# Altium schematic sheet 04_Inputs_19-27.SchDoc
size 594 x 420 mm; DocumentNumber: Входы сухой контакт; SheetNumber: 4; SheetTotal: 6
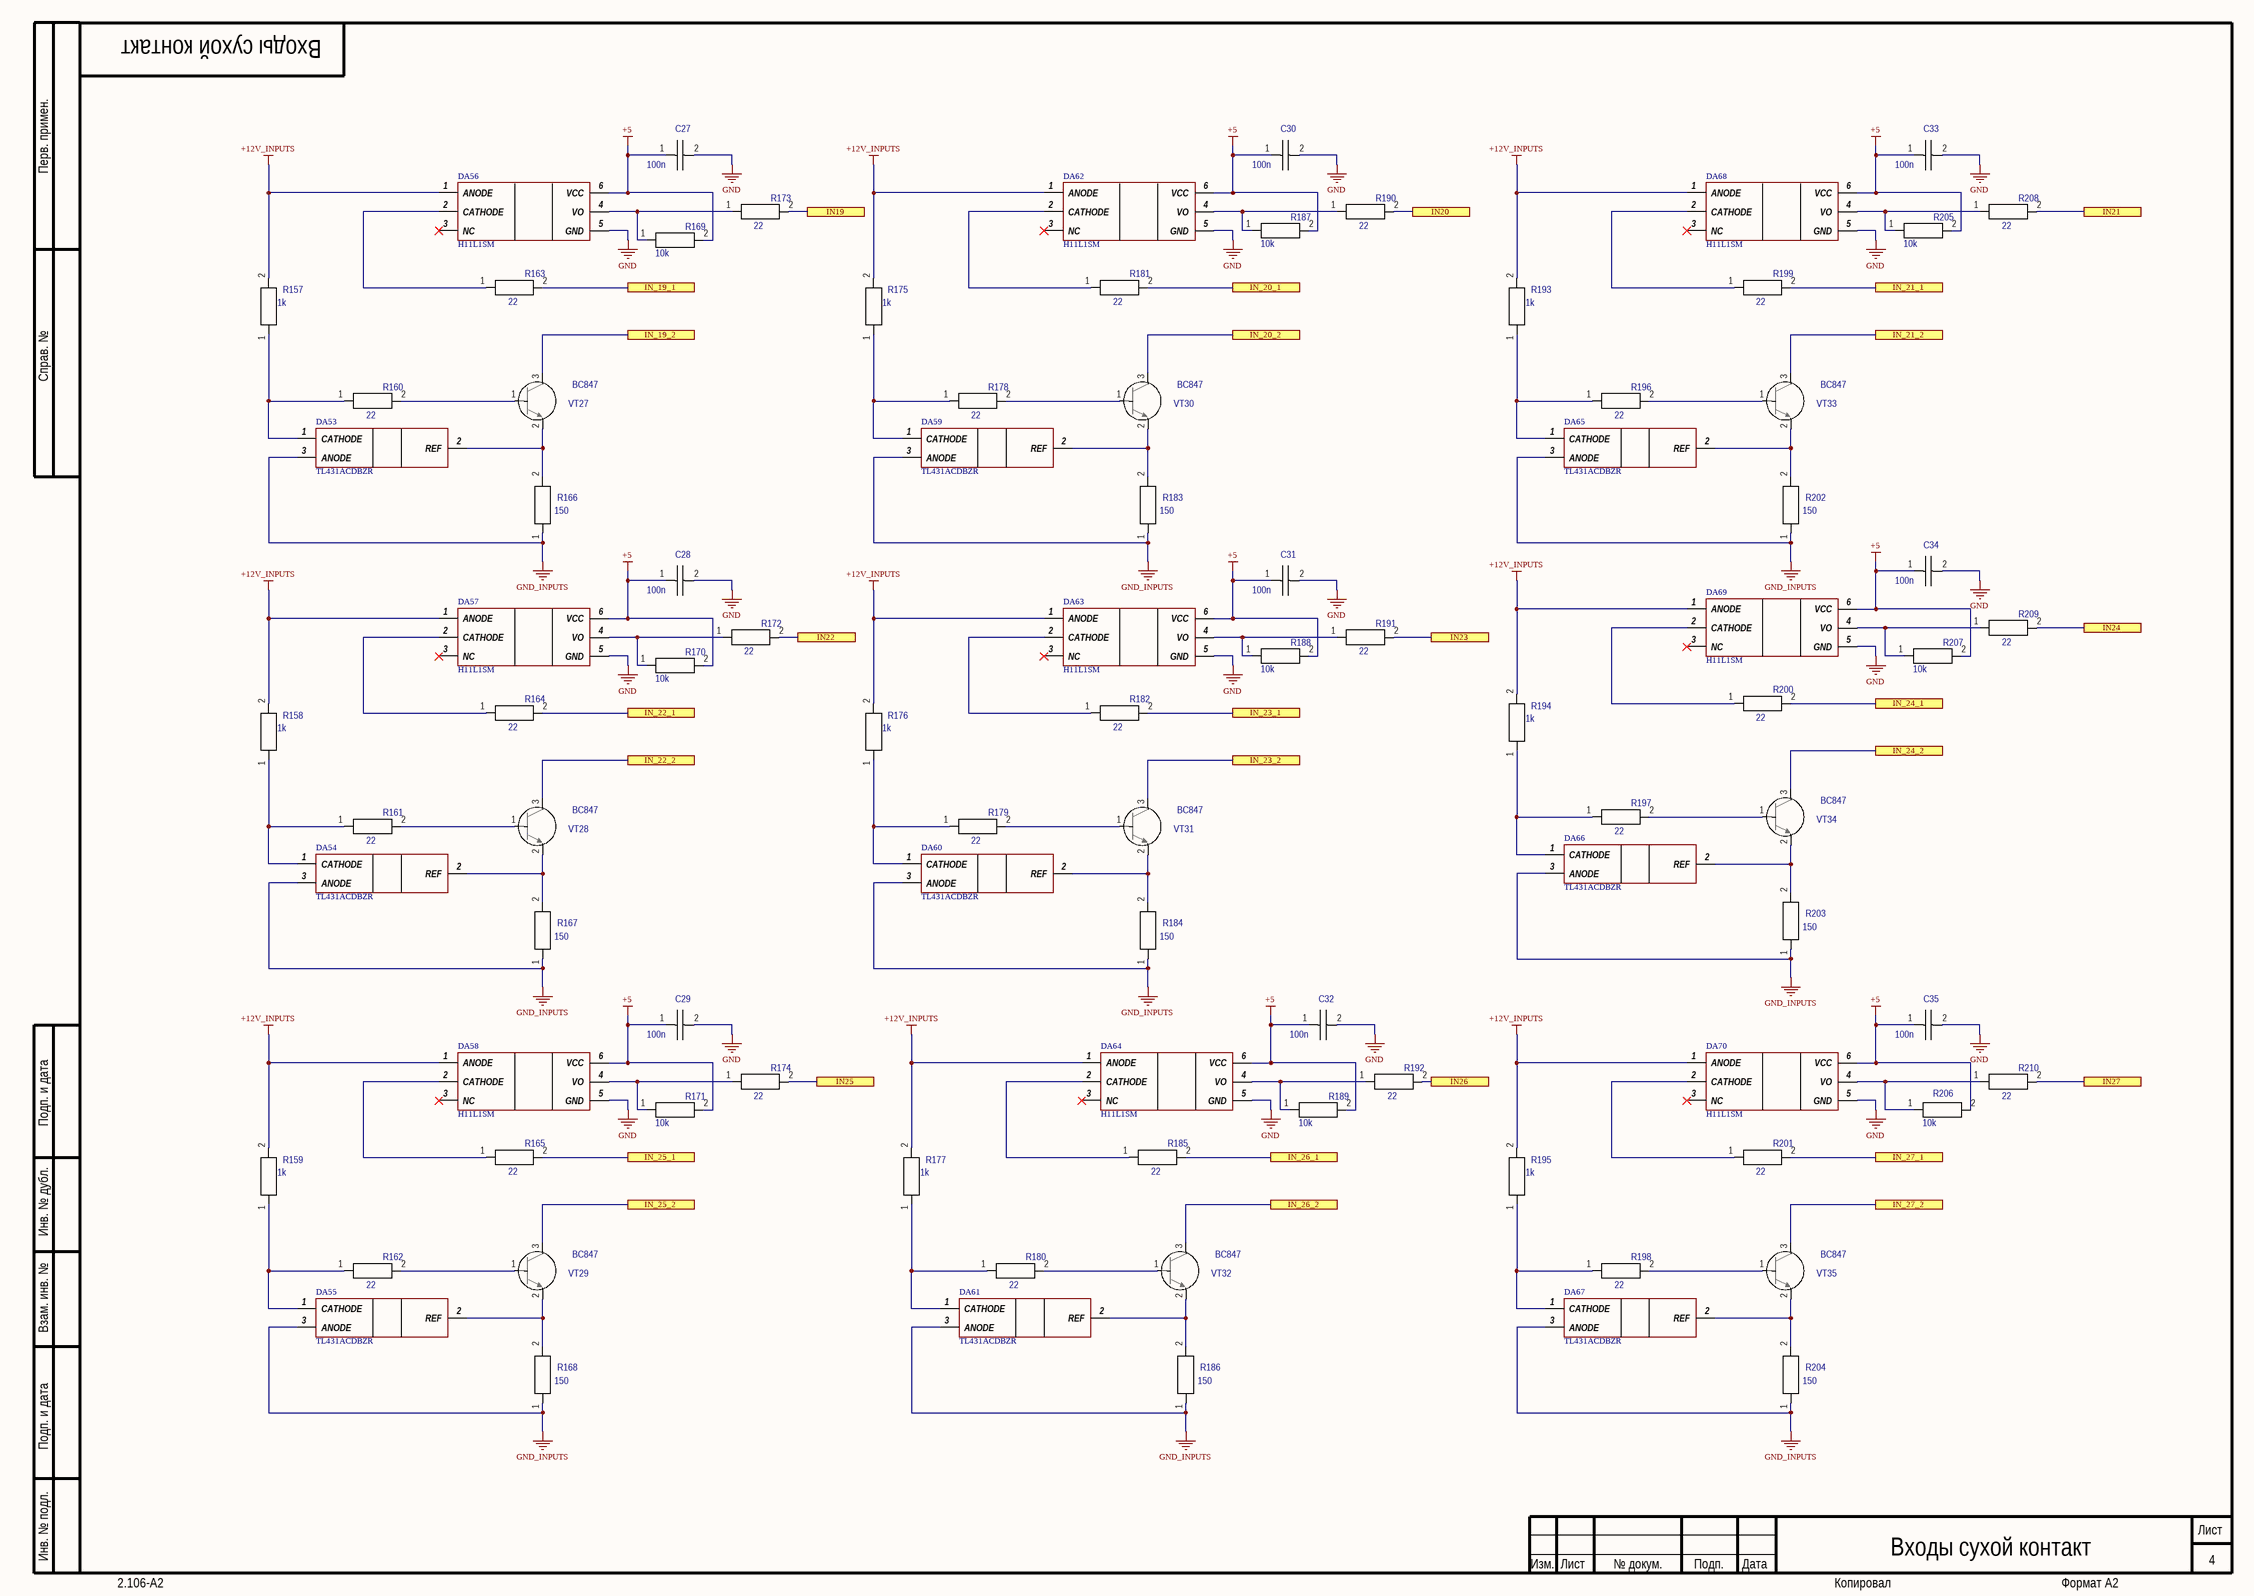
[diagram p0: 04_Inputs_19-27.SchDoc]

## Parts
C27  value 100n  [C0603]  (hidden comment: C0603)
C28  value 100n  [C0603]  (hidden comment: C0603)
C29  value 100n  [C0603]  (hidden comment: C0603)
C30  value 100n  [C0603]  (hidden comment: C0603)
C31  value 100n  [C0603]  (hidden comment: C0603)
C32  value 100n  [C0603]  (hidden comment: C0603)
C33  value 100n  [C0603]  (hidden comment: C0603)
C34  value 100n  [C0603]  (hidden comment: C0603)
C35  value 100n  [C0603]  (hidden comment: C0603)
DA53  TL431ACDBZR  [SOT95P237X112-3N]
DA54  TL431ACDBZR  [SOT95P237X112-3N]
DA55  TL431ACDBZR  [SOT95P237X112-3N]
DA56  H11L1SM  [SOP254P1030X460-6N]
DA57  H11L1SM  [SOP254P1030X460-6N]
DA58  H11L1SM  [SOP254P1030X460-6N]
DA59  TL431ACDBZR  [SOT95P237X112-3N]
DA60  TL431ACDBZR  [SOT95P237X112-3N]
DA61  TL431ACDBZR  [SOT95P237X112-3N]
DA62  H11L1SM  [SOP254P1030X460-6N]
DA63  H11L1SM  [SOP254P1030X460-6N]
DA64  H11L1SM  [SOP254P1030X460-6N]
DA65  TL431ACDBZR  [SOT95P237X112-3N]
DA66  TL431ACDBZR  [SOT95P237X112-3N]
DA67  TL431ACDBZR  [SOT95P237X112-3N]
DA68  H11L1SM  [SOP254P1030X460-6N]
DA69  H11L1SM  [SOP254P1030X460-6N]
DA70  H11L1SM  [SOP254P1030X460-6N]
R157  value 1k  [RESC1608N]  (hidden comment: R0603)
R158  value 1k  [RESC1608N]  (hidden comment: R0603)
R159  value 1k  [RESC1608N]  (hidden comment: R0603)
R160  value 22  [RESC1608N]  (hidden comment: R0603)
R161  value 22  [RESC1608N]  (hidden comment: R0603)
R162  value 22  [RESC1608N]  (hidden comment: R0603)
R163  value 22  [RESC1608N]  (hidden comment: R0603)
R164  value 22  [RESC1608N]  (hidden comment: R0603)
R165  value 22  [RESC1608N]  (hidden comment: R0603)
R166  value 150  [RESC1608N]  (hidden comment: R0603)
R167  value 150  [RESC1608N]  (hidden comment: R0603)
R168  value 150  [RESC1608N]  (hidden comment: R0603)
R169  value 10k  [RESC1608N]  (hidden comment: R0603)
R170  value 10k  [RESC1608N]  (hidden comment: R0603)
R171  value 10k  [RESC1608N]  (hidden comment: R0603)
R172  value 22  [RESC1608N]  (hidden comment: R0603)
R173  value 22  [RESC1608N]  (hidden comment: R0603)
R174  value 22  [RESC1608N]  (hidden comment: R0603)
R175  value 1k  [RESC1608N]  (hidden comment: R0603)
R176  value 1k  [RESC1608N]  (hidden comment: R0603)
R177  value 1k  [RESC1608N]  (hidden comment: R0603)
R178  value 22  [RESC1608N]  (hidden comment: R0603)
R179  value 22  [RESC1608N]  (hidden comment: R0603)
R180  value 22  [RESC1608N]  (hidden comment: R0603)
R181  value 22  [RESC1608N]  (hidden comment: R0603)
R182  value 22  [RESC1608N]  (hidden comment: R0603)
R183  value 150  [RESC1608N]  (hidden comment: R0603)
R184  value 150  [RESC1608N]  (hidden comment: R0603)
R185  value 22  [RESC1608N]  (hidden comment: R0603)
R186  value 150  [RESC1608N]  (hidden comment: R0603)
R187  value 10k  [RESC1608N]  (hidden comment: R0603)
R188  value 10k  [RESC1608N]  (hidden comment: R0603)
R189  value 10k  [RESC1608N]  (hidden comment: R0603)
R190  value 22  [RESC1608N]  (hidden comment: R0603)
R191  value 22  [RESC1608N]  (hidden comment: R0603)
R192  value 22  [RESC1608N]  (hidden comment: R0603)
R193  value 1k  [RESC1608N]  (hidden comment: R0603)
R194  value 1k  [RESC1608N]  (hidden comment: R0603)
R195  value 1k  [RESC1608N]  (hidden comment: R0603)
R196  value 22  [RESC1608N]  (hidden comment: R0603)
R197  value 22  [RESC1608N]  (hidden comment: R0603)
R198  value 22  [RESC1608N]  (hidden comment: R0603)
R199  value 22  [RESC1608N]  (hidden comment: R0603)
R200  value 22  [RESC1608N]  (hidden comment: R0603)
R201  value 22  [RESC1608N]  (hidden comment: R0603)
R202  value 150  [RESC1608N]  (hidden comment: R0603)
R203  value 150  [RESC1608N]  (hidden comment: R0603)
R204  value 150  [RESC1608N]  (hidden comment: R0603)
R205  value 10k  [RESC1608N]  (hidden comment: R0603)
R206  value 10k  [RESC1608N]  (hidden comment: R0603)
R207  value 10k  [RESC1608N]  (hidden comment: R0603)
R208  value 22  [RESC1608N]  (hidden comment: R0603)
R209  value 22  [RESC1608N]  (hidden comment: R0603)
R210  value 22  [RESC1608N]  (hidden comment: R0603)
VT27  BC847  [SOT23-3N]
VT28  BC847  [SOT23-3N]
VT29  BC847  [SOT23-3N]
VT30  BC847  [SOT23-3N]
VT31  BC847  [SOT23-3N]
VT32  BC847  [SOT23-3N]
VT33  BC847  [SOT23-3N]
VT34  BC847  [SOT23-3N]
VT35  BC847  [SOT23-3N]

## Ports
IN19, IN20, IN21, IN22, IN23, IN24, IN25, IN26, IN27, IN_19_1, IN_19_2, IN_20_1, IN_20_2, IN_21_1, IN_21_2, IN_22_1, IN_22_2, IN_23_1, IN_23_2, IN_24_1, IN_24_2, IN_25_1, IN_25_2, IN_26_1, IN_26_2, IN_27_1, IN_27_2

## Nets
+5: C27.1 C28.1 C29.1 C30.1 C31.1 C32.1 C33.1 C34.1 C35.1 DA56.6(VCC) DA57.6(VCC) DA58.6(VCC) DA62.6(VCC) DA63.6(VCC) DA64.6(VCC) DA68.6(VCC) DA69.6(VCC) DA70.6(VCC) R169.2 R170.2 R171.2 R187.2 R188.2 R189.2 R205.2 R206.2 R207.2
+12V_INPUTS: DA56.1(ANODE) DA57.1(ANODE) DA58.1(ANODE) DA62.1(ANODE) DA63.1(ANODE) DA64.1(ANODE) DA68.1(ANODE) DA69.1(ANODE) DA70.1(ANODE) R157.2 R158.2 R159.2 R175.2 R176.2 R177.2 R193.2 R194.2 R195.2
GND: C27.2 C28.2 C29.2 C30.2 C31.2 C32.2 C33.2 C34.2 C35.2 DA56.5(GND) DA57.5(GND) DA58.5(GND) DA62.5(GND) DA63.5(GND) DA64.5(GND) DA68.5(GND) DA69.5(GND) DA70.5(GND)
GND_INPUTS: DA53.3(ANODE) DA54.3(ANODE) DA55.3(ANODE) DA59.3(ANODE) DA60.3(ANODE) DA61.3(ANODE) DA65.3(ANODE) DA66.3(ANODE) DA67.3(ANODE) R166.1 R167.1 R168.1 R183.1 R184.1 R186.1 R202.1 R203.1 R204.1
IN19: R173.2 ; port IN19
IN20: R190.2 ; port IN20
IN21: R208.2 ; port IN21
IN22: R172.2 ; port IN22
IN23: R191.2 ; port IN23
IN24: R209.2 ; port IN24
IN25: R174.2 ; port IN25
IN26: R192.2 ; port IN26
IN27: R210.2 ; port IN27
IN_19_1: R163.2 ; port IN_19_1
IN_19_2: VT27.3 ; port IN_19_2
IN_20_1: R181.2 ; port IN_20_1
IN_20_2: VT30.3 ; port IN_20_2
IN_21_1: R199.2 ; port IN_21_1
IN_21_2: VT33.3 ; port IN_21_2
IN_22_1: R164.2 ; port IN_22_1
IN_22_2: VT28.3 ; port IN_22_2
IN_23_1: R182.2 ; port IN_23_1
IN_23_2: VT31.3 ; port IN_23_2
IN_24_1: R200.2 ; port IN_24_1
IN_24_2: VT34.3 ; port IN_24_2
IN_25_1: R165.2 ; port IN_25_1
IN_25_2: VT29.3 ; port IN_25_2
IN_26_1: R185.2 ; port IN_26_1
IN_26_2: VT32.3 ; port IN_26_2
IN_27_1: R201.2 ; port IN_27_1
IN_27_2: VT35.3 ; port IN_27_2
NetDA53_1: DA53.1(CATHODE) R157.1 R160.1
NetDA53_2: DA53.2(REF) R166.2 VT27.2
NetDA54_1: DA54.1(CATHODE) R158.1 R161.1
NetDA54_2: DA54.2(REF) R167.2 VT28.2
NetDA55_1: DA55.1(CATHODE) R159.1 R162.1
NetDA55_2: DA55.2(REF) R168.2 VT29.2
NetDA56_2: DA56.2(CATHODE) R163.1
NetDA56_4: DA56.4(VO) R169.1 R173.1
NetDA57_2: DA57.2(CATHODE) R164.1
NetDA57_4: DA57.4(VO) R170.1 R172.1
NetDA58_2: DA58.2(CATHODE) R165.1
NetDA58_4: DA58.4(VO) R171.1 R174.1
NetDA59_1: DA59.1(CATHODE) R175.1 R178.1
NetDA59_2: DA59.2(REF) R183.2 VT30.2
NetDA60_1: DA60.1(CATHODE) R176.1 R179.1
NetDA60_2: DA60.2(REF) R184.2 VT31.2
NetDA61_1: DA61.1(CATHODE) R177.1 R180.1
NetDA61_2: DA61.2(REF) R186.2 VT32.2
NetDA62_2: DA62.2(CATHODE) R181.1
NetDA62_4: DA62.4(VO) R187.1 R190.1
NetDA63_2: DA63.2(CATHODE) R182.1
NetDA63_4: DA63.4(VO) R188.1 R191.1
NetDA64_2: DA64.2(CATHODE) R185.1
NetDA64_4: DA64.4(VO) R189.1 R192.1
NetDA65_1: DA65.1(CATHODE) R193.1 R196.1
NetDA65_2: DA65.2(REF) R202.2 VT33.2
NetDA66_1: DA66.1(CATHODE) R194.1 R197.1
NetDA66_2: DA66.2(REF) R203.2 VT34.2
NetDA67_1: DA67.1(CATHODE) R195.1 R198.1
NetDA67_2: DA67.2(REF) R204.2 VT35.2
NetDA68_2: DA68.2(CATHODE) R199.1
NetDA68_4: DA68.4(VO) R205.1 R208.1
NetDA69_2: DA69.2(CATHODE) R200.1
NetDA69_4: DA69.4(VO) R207.1 R209.1
NetDA70_2: DA70.2(CATHODE) R201.1
NetDA70_4: DA70.4(VO) R206.1 R210.1
NetR160_2: R160.2 VT27.1
NetR161_2: R161.2 VT28.1
NetR162_2: R162.2 VT29.1
NetR178_2: R178.2 VT30.1
NetR179_2: R179.2 VT31.1
NetR180_2: R180.2 VT32.1
NetR196_2: R196.2 VT33.1
NetR197_2: R197.2 VT34.1
NetR198_2: R198.2 VT35.1

Not connected (* = marked no-connect by the designer): DA56 3(NC)*; DA57 3(NC)*; DA58 3(NC)*; DA62 3(NC)*; DA63 3(NC)*; DA64 3(NC)*; DA68 3(NC)*; DA69 3(NC)*; DA70 3(NC)*

## Notes on the sheet
- Перв. примен.
- Справ. №
- Подп. и дата
- Инв. № дубл.
- Взам. инв. №
- Инв. № подл.
- Изм.
- Лист
- № докум.
- Подп.
- Дата
- 2.106-A2
- Копировал
- Формат А2

## Library data of the parts
C27-C35 = GRM188R71C104KA01D: Manufacturer: Murata Manufacturing; Код: 22; ID: Конденсатор; Power/Voltage: 16V; Tolerance: ±10%; TKE: X7R; iii: Конденсатор GRM188R71C104KA01D 100n 16V ±10% C0603 X7R  Murata Manufacturing; Comments: C0603; Part Number: GRM188R71C104KA01D; Height: 0.9; Package: C0603; TemperatureMin: -55; TemperatureMax: 125
DA53-DA55 DA59-DA61 DA65-DA67 = TL431ACDBZR: Integrated Circuit; Manufacturer_Name: Texas Instruments; Datasheet Link: https://datasheet.datasheetarchive.com/originals/distributors/SFDatasheet-6/sf-000131849.pdf; Manufacturer_Part_Number: TL431ACDBZR; Mouser Part Number: 595-TL431ACDBZR; Mouser Price/Stock: https://www.mouser.co.uk/ProductDetail/Texas-Instruments/TL431ACDBZR?qs=odmYgEirbwzMcBuFx%2Fo8hQ%3D%3D; Arrow Part Number: TL431ACDBZR; Arrow Price/Stock: https://www.arrow.com/en/products/tl431acdbzr/texas-instruments?region=nac; PartNumber: TL431ACDBZR
DA56-DA58 DA62-DA64 DA68-DA70 = H11L1SM: Integrated Circuit; Manufacturer_Name: Iso Com; Datasheet Link: http://isocom.com/wp-content/uploads/2017/09/DD93224-H11L1_H11L1V-110817.pdf; Height: 4.6mm; Manufacturer_Part_Number: H11L1SM; PartNumber: H11L1SM
R157-R159 R175-R177 R193-R195 = RC0603FK-071KL: Manufacturer: Тайвань; Код: 31; ID: Резистор; Power/Voltage: 0.063W/50V; Tolerance: ±1%; iii: Резистор RC0603FK-071KL 1k 0.063W/50V ±1% R0603  Тайвань; Comments: R0603; Part Number: RC0603FK-071KL; Package: R0603; TemperatureMin: -55; TemperatureMax: 155
R160-R165 R172-R174 R178-R182 R185 R190-R192 R196-R201 R208-R210 = RC0603FK-0722RL: Manufacturer: Тайвань; Код: 11; ID: Резистор; Power/Voltage: 0.063W/50V; Tolerance: ±1%; iii: Резистор RC0603FK-0722RL 22 0.063W/50V ±1% R0603  Тайвань; Comments: R0603; Part Number: RC0603FK-0722RL; Package: R0603; TemperatureMin: -55; TemperatureMax: 155
R166-R168 R183 R184 R186 R202-R204 = RC0603FK-07150RL: Manufacturer: Тайвань; Код: 17; ID: Резистор; Power/Voltage: 0.063W/50V; Tolerance: ±1%; iii: Резистор RC0603FK-07150RL 150 0.063W/50V ±1% R0603  Тайвань; Comments: R0603; Part Number: RC0603FK-07150RL; Package: R0603; TemperatureMin: -55; TemperatureMax: 155
R169-R171 R187-R189 R205-R207 = RC0603FK-0710KL: Part Number: RC0603FR-0710KL; Manufacturer: Тайвань; Код: 26; ID: Резистор; Power/Voltage: 0.063W/50V; Tolerance: ±1%; iii: Резистор RC0603FK-0710KL 10k 0.063W/50V ±1% R0603  Тайвань; Comments: R0603; Package: R0603; TemperatureMin: -55; TemperatureMax: 155
VT27-VT35 = BC847: Manufacturer: NXP Semiconductor; Код: 2; ID: Транзистор; Value: 0.1A; Power/Voltage: 45V; iii: Транзистор BC847 0.1A 45V  sot23  NXP Semiconductor; Com: BC847; Part Number: BC847; Package: sot23